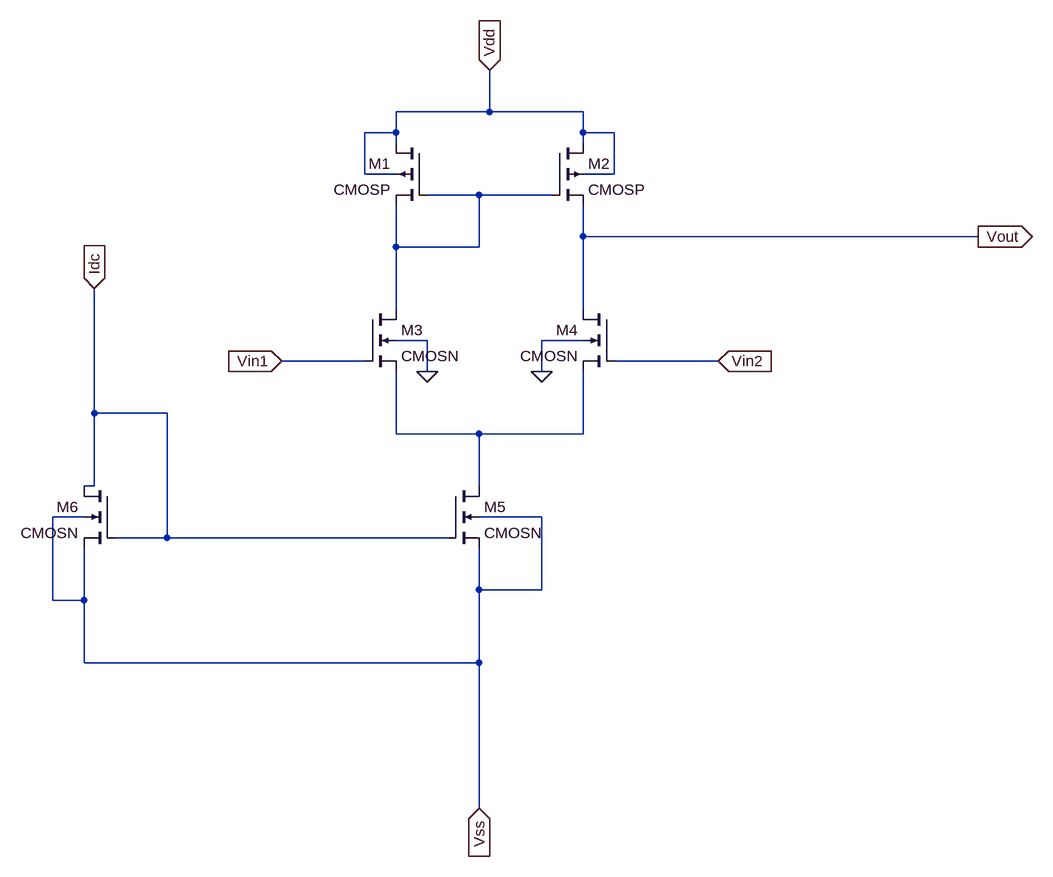
[diagram p0: schematic OTA for filter.asc]
OTA for filter.asc, the LTspice schematic file:
Version 4
SHEET 1 4532 1144
WIRE 1648 -80 1648 -144
WIRE 1648 -80 1504 -80
WIRE 1792 -80 1648 -80
WIRE 1504 -48 1504 -80
WIRE 1504 -48 1456 -48
WIRE 1792 -48 1792 -80
WIRE 1840 -48 1792 -48
WIRE 1504 -32 1504 -48
WIRE 1792 -32 1792 -48
WIRE 1456 16 1456 -48
WIRE 1504 16 1456 16
WIRE 1840 16 1840 -48
WIRE 1840 16 1792 16
WIRE 1632 48 1552 48
WIRE 1744 48 1632 48
WIRE 1792 112 1792 64
WIRE 2400 112 1792 112
WIRE 1504 128 1504 64
WIRE 1632 128 1632 48
WIRE 1632 128 1504 128
WIRE 1504 224 1504 128
WIRE 1792 224 1792 112
WIRE 1552 272 1504 272
WIRE 1792 272 1728 272
WIRE 1456 304 1328 304
WIRE 2000 304 1840 304
WIRE 1552 320 1552 272
WIRE 1728 320 1728 272
WIRE 1040 384 1040 192
WIRE 1152 384 1040 384
WIRE 1504 416 1504 320
WIRE 1632 416 1504 416
WIRE 1792 416 1792 320
WIRE 1792 416 1632 416
WIRE 1040 496 1040 384
WIRE 1040 496 1024 496
WIRE 1632 496 1632 416
WIRE 1024 544 976 544
WIRE 1728 544 1632 544
WIRE 1152 576 1152 384
WIRE 1152 576 1072 576
WIRE 1584 576 1152 576
WIRE 1632 656 1632 592
WIRE 1728 656 1728 544
WIRE 1728 656 1632 656
WIRE 976 672 976 544
WIRE 1024 672 1024 592
WIRE 1024 672 976 672
WIRE 1024 768 1024 672
WIRE 1632 768 1632 656
WIRE 1632 768 1024 768
WIRE 1632 992 1632 768
FLAG 1552 320 0
FLAG 1728 320 0
FLAG 1328 304 Vin1
IOPIN 1328 304 In
FLAG 2000 304 Vin2
IOPIN 2000 304 In
FLAG 2400 112 Vout
IOPIN 2400 112 Out
FLAG 1648 -144 Vdd
IOPIN 1648 -144 In
FLAG 1040 192 Idc
IOPIN 1040 192 In
FLAG 1632 992 Vss
IOPIN 1632 992 In
SYMBOL pmos4 1552 -32 M0
SYMATTR InstName M1
SYMATTR Value2 l=1u w=42u
SYMATTR Value CMOSP
SYMBOL pmos4 1744 -32 R0
SYMATTR InstName M2
SYMATTR Value2 l=1u w=42u
SYMATTR Value CMOSP
SYMBOL nmos4 1456 224 R0
SYMATTR InstName M3
SYMATTR Value2 l=1u w=8.5u
SYMATTR Value CMOSN
SYMBOL nmos4 1840 224 M0
SYMATTR InstName M4
SYMATTR Value2 l=1u w=8.5u
SYMATTR Value CMOSN
SYMBOL nmos4 1584 496 R0
SYMATTR InstName M5
SYMATTR Value2 l=1u w=5.6u
SYMATTR Value CMOSN
SYMBOL nmos4 1072 496 M0
SYMATTR InstName M6
SYMATTR Value2 l=1u w=5.6u
SYMATTR Value CMOSN

The netlist it stands for:
* OTA for filter.asc
M1 Vdd N001 N001 Vdd CMOSP l=1u w=42u
M2 Vdd N001 Vout Vdd CMOSP l=1u w=42u
M3 N001 Vin1 N002 0 CMOSN l=1u w=8.5u
M4 Vout Vin2 N002 0 CMOSN l=1u w=8.5u
M5 N002 Idc Vss Vss CMOSN l=1u w=5.6u
M6 Idc Idc Vss Vss CMOSN l=1u w=5.6u
.model NMOS NMOS
.model PMOS PMOS
.lib standard.mos
.backanno
.end